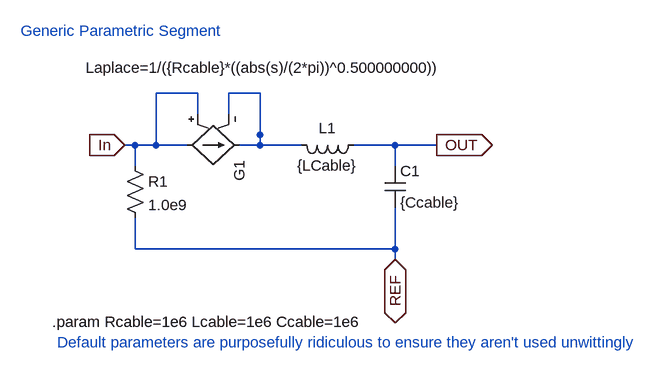
[diagram p0: schematic GenericParameterizedModel.asc]
GenericParameterizedModel.asc, the LTspice schematic file:
Version 4
SHEET 1 880 704
WIRE -96 -64 -160 -64
WIRE 0 -64 -48 -64
WIRE -96 -32 -96 -64
WIRE -48 -32 -48 -64
WIRE -192 16 -208 16
WIRE -160 16 -160 -64
WIRE -160 16 -192 16
WIRE -112 16 -160 16
WIRE 0 16 0 -64
WIRE 0 16 -32 16
WIRE 64 16 0 16
WIRE 208 16 144 16
WIRE 272 16 208 16
WIRE -192 48 -192 16
WIRE 208 48 208 16
WIRE -192 176 -192 128
WIRE 208 176 208 112
WIRE 208 176 -192 176
WIRE 208 192 208 176
WIRE 0 0 0 0
FLAG -208 16 In
IOPIN -208 16 In
FLAG 272 16 OUT
IOPIN 272 16 Out
FLAG 208 192 REF
IOPIN 208 192 BiDir
SYMBOL ind 160 0 R90
WINDOW 0 5 56 VBottom 2
WINDOW 3 32 56 VTop 2
SYMATTR InstName L1
SYMATTR Value {LCable}
SYMBOL cap 192 48 R0
SYMATTR InstName C1
SYMATTR Value {Ccable}
SYMBOL g2 -16 16 R90
WINDOW 3 -119 -302 VRight 2
SYMATTR Value Laplace=1/({Rcable}*((abs(s)/(2*pi))^0.500000000))
SYMATTR InstName G1
SYMBOL res -208 32 R0
SYMATTR InstName R1
SYMATTR Value 1.0e9
TEXT -368 -160 Left 2 ;Generic Parametric Segment
TEXT -320 288 Left 2 !.param Rcable=1e6 Lcable=1e6 Ccable=1e6
TEXT -312 320 Left 2 ;Default parameters are purposefully ridiculous to ensure they aren't used unwittingly

The netlist it stands for:
* GenericParameterizedModel.asc
L1 OUT N001 {LCable}
C1 OUT REF {Ccable}
G1 In N001 In N001 Laplace=1/({Rcable}*((abs(s)/(2*pi))^0.500000000))
R1 In REF 1.0e9
* Generic Parametric Segment
.param Rcable=1e6 Lcable=1e6 Ccable=1e6
* Default parameters are purposefully ridiculous to ensure they aren't used unwittingly
.backanno
.end